# EAGLE schematic Alfa_t (EAGLE 9.6.2)
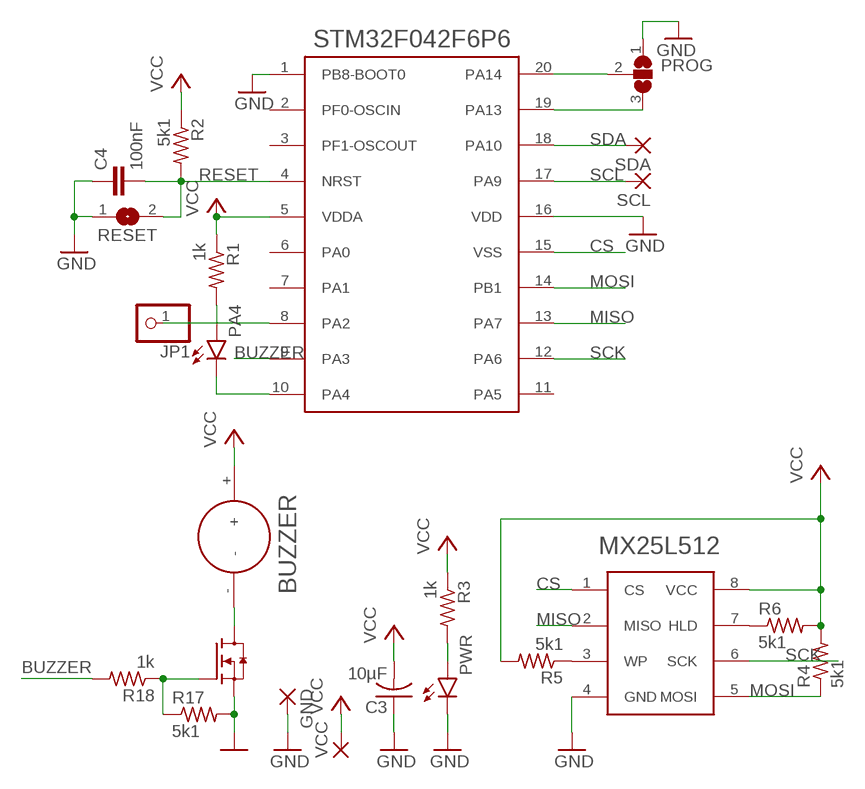
[diagram p0: schematic, sheet 1]

## Parts
BUZ  SI2302CDS  [SOT23-3]
BUZZER  BUZZER-5V  [BUZZER]
C3  10µF  C-USC1206  [C1206]
C4  100nF  C-EUC0603  [C0603]
GND  SMD2  [SMD1,27-2,54]
JP1  PINHD-1X1  [1X01]
MX25L512  MX25L25645  [SOP8]
PA4  LEDCHIPLED_0603  [CHIPLED_0603]
PROG  SJ2W  [SJ_2]
PWR  LEDCHIPLED_0603  [CHIPLED_0603]
R1  1k  R-US_R0603  [R0603]
R2  5k1  R-US_R0603  [R0603]
R3  1k  R-US_R0603  [R0603]
R4  5k1  R-US_R0603  [R0603]
R5  5k1  R-US_R0603  [R0603]
R6  5k1  R-US_R0603  [R0603]
R17  5k1  R-US_R0603  [R0603]
R18  1k  R-US_R0603  [R0603]
RESET  SJ  [SJ]
SCL  SMD2  [SMD1,27-2,54]
SDA  SMD2  [SMD1,27-2,54]
STM32F042F6P6  STM32F042F6P6  [TSSOP-20]
VCC  SMD2  [SMD1,27-2,54]

## Nets
BUZZER: R18.2 STM32F042F6P6.9(PA3)
CS: MX25L512.1(CS) STM32F042F6P6.15(VSS)
GND: BUZ.2(S) C3.1 C4.1 GND.1(P) MX25L512.4(GND) PROG.1 PWR.C R17.2 RESET.1 STM32F042F6P6.1(PB8-BOOT0) STM32F042F6P6.16(VDD)
MISO: MX25L512.2(MISO) STM32F042F6P6.13(PA7)
MOSI: MX25L512.5(MOSI) R4.1 STM32F042F6P6.14(PB1)
N$1: BUZ.3(D) BUZZER.-
N$2: PROG.2 STM32F042F6P6.20(PA14)
N$3: PROG.3 STM32F042F6P6.19(PA13)
N$4: PWR.A R3.2
N$5: PA4.A R1.2
N$6: PA4.C STM32F042F6P6.10(PA4)
N$7: JP1.1 STM32F042F6P6.8(PA2)
N$8: MX25L512.3(WP) R5.1
N$9: BUZ.1(G) R17.1 R18.1
N$11: MX25L512.7(HLD) R6.1
RESET: C4.2 R2.2 RESET.2 STM32F042F6P6.4(NRST)
SCK: MX25L512.6(SCK) STM32F042F6P6.12(PA6)
SCL: SCL.1(P) STM32F042F6P6.17(PA9)
SDA: SDA.1(P) STM32F042F6P6.18(PA10)
VCC: BUZZER.+ C3.2 MX25L512.8(VCC) R1.1 R2.1 R3.1 R4.2 R5.2 R6.2 STM32F042F6P6.5(VDDA) VCC.1(P)
Unconnected: STM32F042F6P6.2(PF0-OSCIN) STM32F042F6P6.3(PF1-OSCOUT) STM32F042F6P6.6(PA0) STM32F042F6P6.7(PA1) STM32F042F6P6.11(PA5)

## Library data of the parts
BUZ = CanCubeSat:SI2302CDS
BUZZER = CanCubeSat:BUZZER-5V
C3 = rcl:C-US: CAPACITOR, American symbol; SPICEPREFIX: C
C4 = rcl:C-EU: CAPACITOR, European symbol; SPICEPREFIX: C
GND SCL SDA VCC = wirepad:SMD2: SMD PAD
JP1 = pinhead:PINHD-1X1: PIN HEADER
MX25L512 = HM:MX25L25645
PA4 PWR = led:LED: LED OSRAM: - CHIPLED LG R971, LG N971, LY N971, LG Q971, LY Q971, LO R971, LY R971 LH N974, LH R974 LS Q976, LO Q976, LY Q976 LO Q996 - Hyper CHIPLED LW Q18S LB Q993, LB Q99A, LB R99A - SideLED LS A670, LO A670, LY A670, LG A670, LP A670 LB A673, LV A673, LT A673, LW A673 LH A674 LY A675 LS A676, LA A676, LO A676, LY A676, LW A676 LS A679, LY A679, LG A679 - Hyper Micro SIDELED® LS Y876, LA Y876, LO Y876, LY Y876 LT Y87S - SmartLED LW L88C, LW L88S LB L89C, LB L89S, LG L890 LS L89K, LO L89K, LY L89K LS L896, LA L896, LO L896, LY L896 - TOPLED LS T670, LO T670, LY T670, LG T670, LP T670 LSG T670, LSP T670, LSY T670, LOP T670, LYG T670 LG T671, LOG T671, LSG T671 LB T673, LV T673, LT T673, LW T673 LH T674 LS T676, LA T676, LO T676, LY T676, LB T676, LH T676, LSB T676, LW T676 LB T67C, LV T67C, LT T67C, LS T67K, LO T67K, LY T67K, LW E67C LS E67B, LA E67B, LO E67B, LY E67B, LB E67C, LV E67C, LT E67C LW T67C LS T679, LY T679, LG T679 LS T770, LO T770, LY T770, LG T770, LP T770 LB T773, LV T773, LT T773, LW T773 LH T774 LS E675, LA E675, LY E675, LS T675 LS T776, LA T776, LO T776, LY T776, LB T776 LHGB T686 LT T68C, LB T68C - Hyper Mini TOPLED® LB M676 - Mini TOPLED Santana® LG M470 LS M47K, LO M47K, LY M47K Source: http://www.osram.convergy.de LUXEON: - LUMILED® LXK2-PW12-R00, LXK2-PW12-S00, LXK2-PW14-U00, LXK2-PW14-V00 LXK2-PM12-R00, LXK2-PM12-S00, LXK2-PM14-U00 LXK2-PE12-Q00, LXK2-PE12-R00, LXK2-PE12-S00, LXK2-PE14-T00, LXK2-PE14-U00 LXK2-PB12-K00, LXK2-PB12-L00, LXK2-PB12-M00, LXK2-PB14-N00, LXK2-PB14-P00, LXK2-PB14-Q00 LXK2-PR12-L00, LXK2-PR12-M00, LXK2-PR14-Q00, LXK2-PR14-R00 LXK2-PD12-Q00, LXK2-PD12-R00, LXK2-PD12-S00 LXK2-PH12-R00, LXK2-PH12-S00 LXK2-PL12-P00, LXK2-PL12-Q00, LXK2-PL12-R00 Source: www.luxeon.com KINGBRIGHT: KA-3528ASYC Source: www.kingbright.com
PROG = jumper:SJ2W: SMD solder JUMPER
R1-R6 R17 R18 = rcl:R-US_: RESISTOR, American symbol; SPICEPREFIX: R
RESET = jumper:SJ: SMD solder JUMPER
STM32F042F6P6 = Kunosheru:STM32F042F6P6